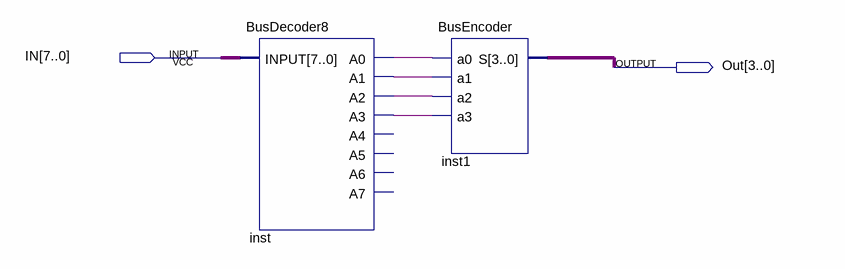
[diagram p0: schematic sheet]
// Quartus schematic Convert8To4.bdf as structural Verilog: 2 symbols, 2 pins
module Convert8To4 (
  input  [7:0] IN,
  output [3:0] Out
);

  wire inst_a0, inst_a1, inst_a2, inst_a3;

  BusDecoder8 inst (.INPUT(IN), .A0(inst_a0), .A1(inst_a1), .A2(inst_a2), .A3(inst_a3));  // open: A4, A5, A6, A7
  BusEncoder inst1 (.a0(inst_a0), .a1(inst_a1), .a2(inst_a2), .a3(inst_a3), .S(Out));
endmodule
